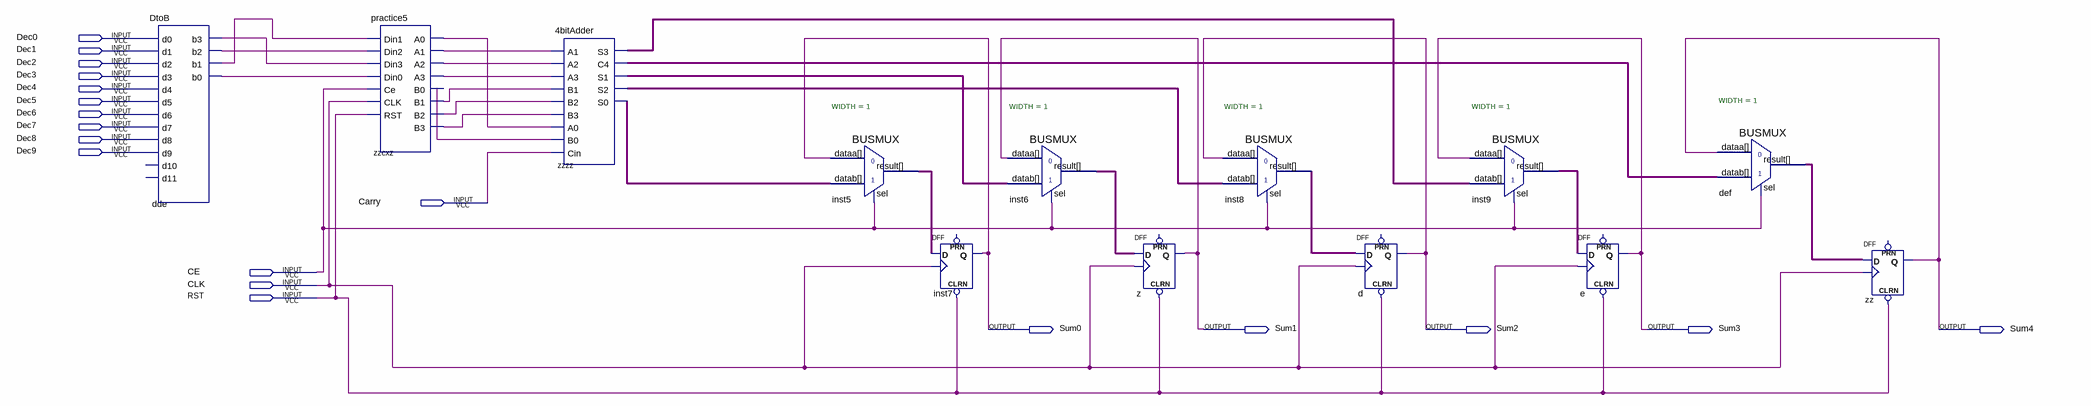
[diagram p0: schematic sheet]
// Quartus schematic practice6.bdf as structural Verilog: 13 symbols, 19 pins
module practice6 (
  input  Dec0,
  input  Dec1,
  input  Dec2,
  input  Dec3,
  input  Dec4,
  input  Dec5,
  input  Dec6,
  input  Dec7,
  input  Dec8,
  input  Dec9,
  input  Carry,
  input  CE,
  input  CLK,
  input  RST,
  output Sum0,
  output Sum1,
  output Sum2,
  output Sum3,
  output Sum4
);

  wire dde_b0, dde_b1, dde_b2, dde_b3, def_result, inst5_result, inst6_result, inst8_result, inst9_result,
       zzcxz_a0, zzcxz_a1, zzcxz_a2, zzcxz_a3, zzcxz_b0, zzcxz_b1, zzcxz_b2, zzcxz_b3, zzzz_c4, zzzz_s0,
       zzzz_s1, zzzz_s2, zzzz_s3;

  DtoB dde (
    .d0(Dec0), .d1(Dec1), .d2(Dec2), .d3(Dec3), .d4(Dec4), .d5(Dec5), .d6(Dec6), .d7(Dec7), .d8(Dec8),
    .d9(Dec9), .b3(dde_b3), .b2(dde_b2), .b1(dde_b1), .b0(dde_b0));  // open: d10, d11
  practice5 zzcxz (
    .Din1(dde_b1), .Din2(dde_b2), .Din3(dde_b3), .Din0(dde_b0), .Ce(CE), .CLK(CLK), .RST(RST), .A0(zzcxz_a0),
    .A1(zzcxz_a1), .A2(zzcxz_a2), .A3(zzcxz_a3), .B0(zzcxz_b0), .B1(zzcxz_b1), .B2(zzcxz_b2), .B3(zzcxz_b3));
  \4bitAdder  zzzz (
    .A1(zzcxz_a1), .A2(zzcxz_a2), .A3(zzcxz_a3), .B1(zzcxz_b1), .B2(zzcxz_b2), .B3(zzcxz_b3), .A0(zzcxz_a0),
    .B0(zzcxz_b0), .Cin(Carry), .S3(zzzz_s3), .C4(zzzz_c4), .S1(zzzz_s1), .S2(zzzz_s2), .S0(zzzz_s0));
  BUSMUX #(.WIDTH(1)) inst5 (.datab(zzzz_s0), .sel(CE), .dataa(Sum0), .result(inst5_result));
  DFF inst7 (.CLRN(RST), .CLK(CLK), .D(inst5_result), .Q(Sum0));  // open: PRN
  BUSMUX #(.WIDTH(1)) inst6 (.datab(zzzz_s1), .sel(CE), .dataa(Sum1), .result(inst6_result));
  DFF z (.CLRN(RST), .CLK(CLK), .D(inst6_result), .Q(Sum1));  // open: PRN
  BUSMUX #(.WIDTH(1)) inst8 (.datab(zzzz_s2), .sel(CE), .dataa(Sum2), .result(inst8_result));
  DFF d (.CLRN(RST), .CLK(CLK), .D(inst8_result), .Q(Sum2));  // open: PRN
  BUSMUX #(.WIDTH(1)) inst9 (.datab(zzzz_s3), .sel(CE), .dataa(Sum3), .result(inst9_result));
  DFF e (.CLRN(RST), .CLK(CLK), .D(inst9_result), .Q(Sum3));  // open: PRN
  BUSMUX #(.WIDTH(1)) def (.datab(zzzz_c4), .sel(CE), .dataa(Sum4), .result(def_result));
  DFF zz (.CLRN(RST), .CLK(CLK), .D(def_result), .Q(Sum4));  // open: PRN
endmodule
